# Altium schematic sheet GPS.SchDoc: Animated Archer Main PCB
size Letter; Author: John Eric Martin; Engineer: John Eric Martin; Organization: UCCS IEEE Robotics; Address1: 1420 Austin Bluffs Pkwy; Address2: Colorado Springs, CO 80918; DocumentNumber: GPS; Revision: 1; SheetNumber: 6; SheetTotal: 10; ProjectName: Animated Archer Quadcopter
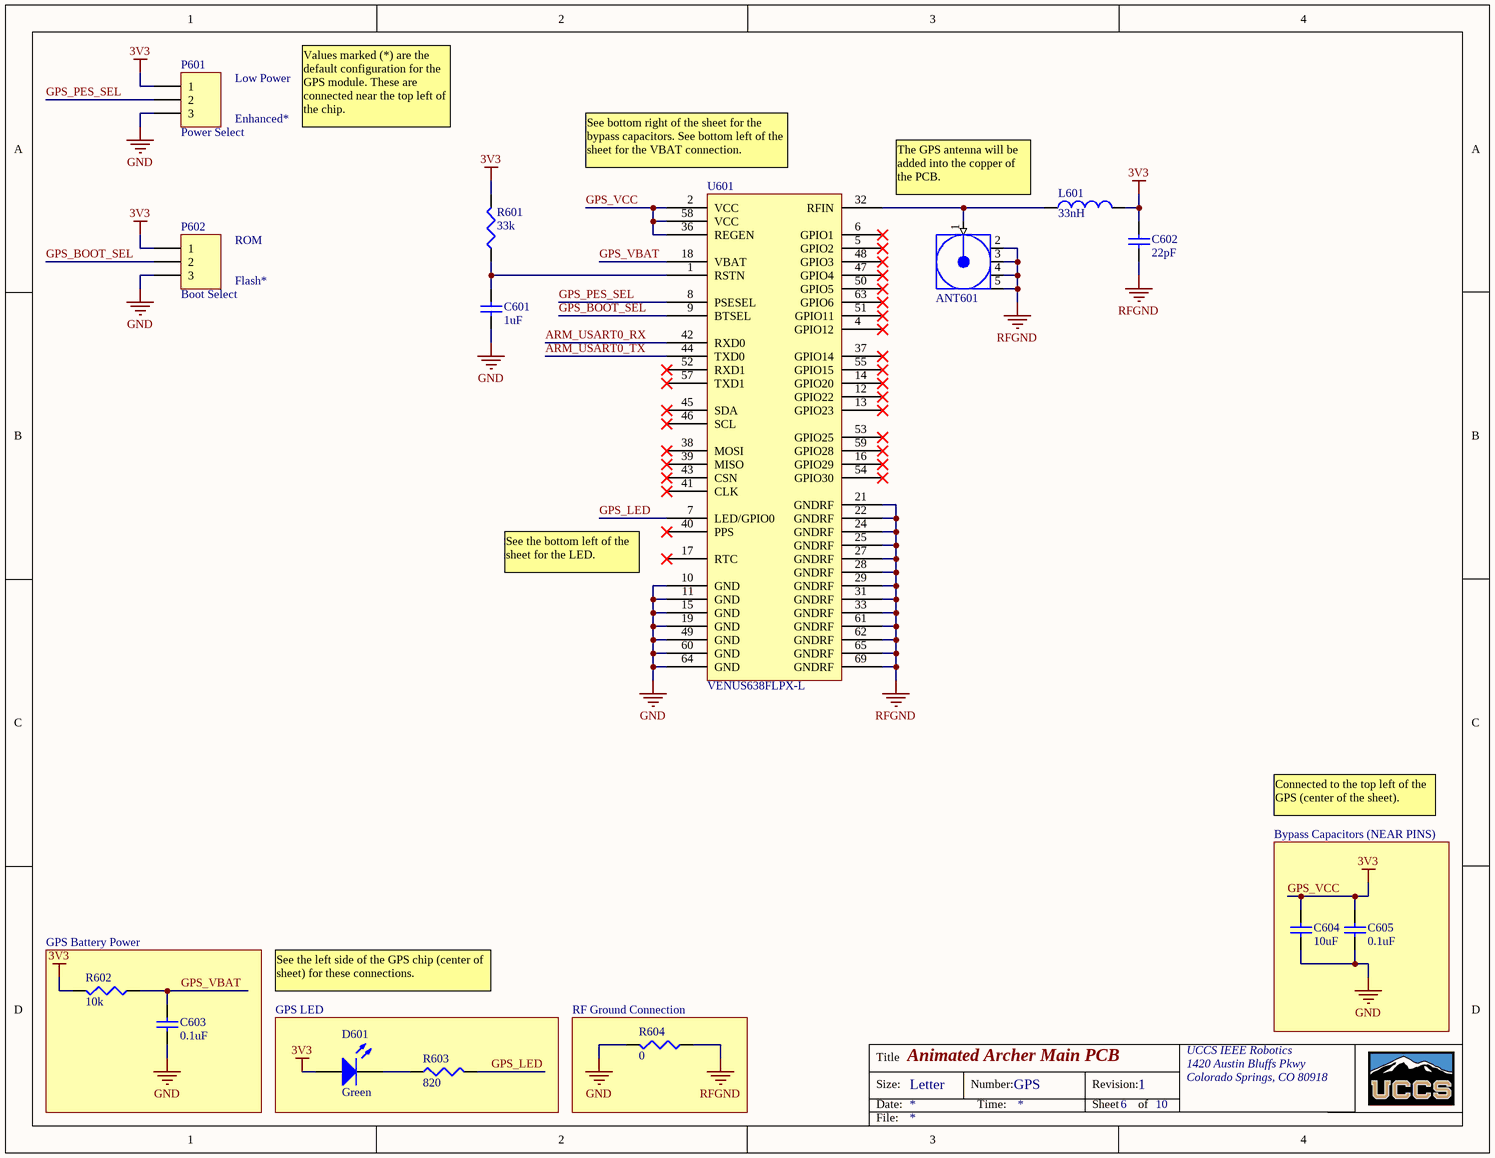
[diagram p0: GPS.SchDoc]

## Parts
ANT601  COAX-M  [MMCX2.54-V5]  (value not drawn)
C601  value 1uF  [1608[0603]]  (hidden comment: 0.1uF)
C602  22pF  [1608[0603]]
C603  0.1uF  [1608[0603]]
C604  value 10uF  [1608[0603]]  (hidden comment: 0.1uF)
C605  0.1uF  [1608[0603]]
D601  Green  [1608[0603]]
L601  value 33nH  [0603]
P601  Power Select  [HDR1X3]
P602  Boot Select  [HDR1X3]
R601  value 33k  [J1-0603]  (hidden comment: Res3)
R602  value 10k  [J1-0603]  (hidden comment: Res3)
R603  value 820  [J1-0603]  (hidden comment: Res3)
R604  value 0  [J1-0603]  (hidden comment: Res3)
U601  VENUS638FLPX-L  [VENUS638FLPX]

## Blocks framed on the sheet
Bypass Capacitors (NEAR PINS): C604 C605
GPS Battery Power: C603 R602
GPS LED: D601 R603
RF Ground Connection: R604

## Nets
GND: C601.1 C603.1 C604.1 C605.1 P601.3 P602.3 R604.2 U601.10(GND) U601.11(GND) U601.15(GND) U601.19(GND) U601.49(GND) U601.60(GND) U601.64(GND)
GPS_VCC: C602.2 C604.2 C605.2 D601.1(A) L601.2 P601.1 P602.1 R601.2 R602.2 U601.2(VCC) U601.36(REGEN) U601.58(VCC)  [also labelled 3V3]
RFGND: ANT601.2(GND) ANT601.3(GND) ANT601.4(GND) ANT601.5(GND) C602.1 R604.1 U601.21(GNDRF) U601.22(GNDRF) U601.24(GNDRF) U601.25(GNDRF) U601.27(GNDRF) U601.28(GNDRF) U601.29(GNDRF) U601.31(GNDRF) U601.33(GNDRF) U601.61(GNDRF) U601.62(GNDRF) U601.65(GNDRF) U601.69(GNDRF)
ARM_USART0_RX: U601.42(RXD0)
ARM_USART0_TX: U601.44(TXD0)
GPS_BOOT_SEL: P602.2 U601.9(BTSEL)
GPS_LED: R603.2 U601.7(LED/GPIO0)
GPS_PES_SEL: P601.2 U601.8(PSESEL)
GPS_VBAT: C603.2 R602.1 U601.18(VBAT)
NetANT601_1: ANT601.1(Signal) L601.1 U601.32(RFIN)
NetC601_2: C601.2 R601.1 U601.1(RSTN)
NetD601_2: D601.2(K) R603.1

Not connected (* = marked no-connect by the designer): U601 4(GPIO12)* 5(GPIO2)* 6(GPIO1)* 12(GPIO22)* 13(GPIO23)* 14(GPIO20)* 16(GPIO29)* 17(RTC)* 37(GPIO14)* 38(MOSI)* 39(MISO)* 40(PPS)* 41(CLK)* 43(CSN)* 45(SDA)* 46(SCL)* 47(GPIO4)* 48(GPIO3)* 50(GPIO5)* 51(GPIO11)* 52(RXD1)* 53(GPIO25)* 54(GPIO30)* 55(GPIO15)* 57(TXD1)* 59(GPIO28)* 63(GPIO6)*

## Notes on the sheet
- Low Power
- Enhanced*
- Values marked (*) are the default configuration for the GPS module. These are connected near the top left of the chip.
- (near U601) See bottom right of the sheet for the bypass capacitors. See bottom left of the sheet for the VBAT connection.
- The GPS antenna will be added into the copper of the PCB.
- ROM
- Flash*
- See the bottom left of the sheet for the LED.
- Connected to the top left of the GPS (center of the sheet).
- See the left side of the GPS chip (center of sheet) for these connections.
- Title
- Size:
- Date:
- Letter
- Number:
- Time:
- Revision:
- Sheet
- of
- File:

## Library data of the parts
ANT601 = COAX-M: RF Coaxial PCB Connector, MMCX; Thru-Hole, Vertical Mount Plug,  50 Ohm Impedance; PackageDocument: Rev. A, 16-Jun-1997; PCB_Layout: Complies with manufacturer's recommendation.; DrillSize: Corresponds to nominal value.; Published: 15-Jul-2004; LatestRevisionDate: 15-Jul-2004; LatestRevisionNote: Component Replaced.; DatasheetDocument: 30-May-2003; PackageReference: 908-21103; Publisher: Altium Limited; ComponentLink1Description: Manufacturer Link; ComponentLink1URL: http://www.amphenolrf.com/
C601-C605 = Cap Semi: Capacitor (Semiconductor SIM Model); Published: 8-Jun-2000; LatestRevisionDate: 29-May-2009; LatestRevisionNote: IPC-7351 Footprint Added.; PackageReference: C1206; Publisher: Altium Limited; PackageDescription: Chip Capacitor
  C602: Value: 22pF
  C603 C605: Value: 0.1uF
D601 = LED2: Typical RED, GREEN, YELLOW, AMBER GaAs LED; Published: 8-Jun-2000; LatestRevisionDate: 17-Jul-2002; LatestRevisionNote: Re-released for DXP Platform.; PackageVersion: Feb-2002; PackageReference: 3.2X1.6X1.1; Publisher: Altium Limited; PackageDescription: SM LED; 2 Flat Leads
L601 = Inductor: Code_IEC: 1005; Published: 8-Jun-2000; LatestRevisionDate: 29-May-2009; LatestRevisionNote: IPC-7351 Footprint Added.; PackageReference: 0402-A; Publisher: Altium Limited; PackageDescription: Chip Inductor; Code_JEITA: 0402
P601 P602 = Header 3: Header, 3-Pin; LatestRevisionDate: 17-Jul-2002; LatestRevisionNote: Re-released for DXP Platform.; Publisher: Altium Limited
R601-R604 = Res3: Resistor; Published: 8-Jun-2000; LatestRevisionDate: 29-May-2009; LatestRevisionNote: IPC-7351 Footprint Added.; PackageReference: J1-0603; Publisher: Altium Limited; PackageDescription: Chip Resistor
U601 = VENUS638FLPX-L: Venus638FLPX-L GPS Receiver